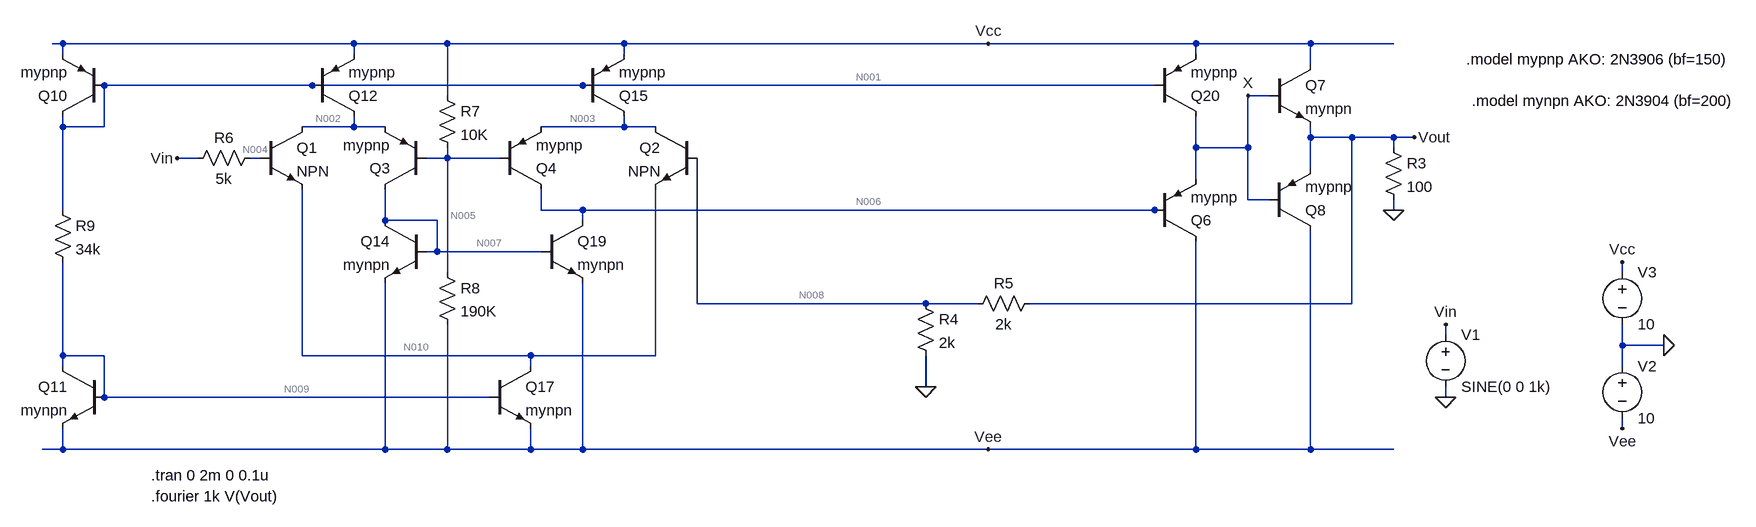
[diagram p0: schematic Design.asc]
Design.asc, the LTspice schematic file:
Version 4
SHEET 1 1876 680
WIRE -736 -240 -752 -240
WIRE -288 -240 -736 -240
WIRE -144 -240 -288 -240
WIRE 128 -240 -144 -240
WIRE 688 -240 128 -240
WIRE 1008 -240 688 -240
WIRE 1184 -240 1008 -240
WIRE 1312 -240 1184 -240
WIRE -736 -224 -736 -240
WIRE -288 -224 -288 -240
WIRE 128 -224 128 -240
WIRE 1008 -224 1008 -240
WIRE 1184 -208 1184 -240
WIRE -352 -176 -672 -176
WIRE 64 -176 -352 -176
WIRE 944 -176 64 -176
WIRE -144 -160 -144 -240
WIRE 1120 -160 1088 -160
WIRE -736 -112 -736 -128
WIRE -672 -112 -672 -176
WIRE -672 -112 -736 -112
WIRE -288 -112 -288 -128
WIRE -288 -112 -368 -112
WIRE -240 -112 -288 -112
WIRE 128 -112 128 -128
WIRE 128 -112 0 -112
WIRE 176 -112 128 -112
WIRE 1184 -96 1184 -112
WIRE 1248 -96 1184 -96
WIRE 1312 -96 1248 -96
WIRE 1344 -96 1312 -96
WIRE 1008 -80 1008 -128
WIRE 1088 -80 1088 -160
WIRE 1088 -80 1008 -80
WIRE 1312 -80 1312 -96
WIRE -528 -64 -560 -64
WIRE -432 -64 -448 -64
WIRE -144 -64 -144 -80
WIRE -144 -64 -176 -64
WIRE -64 -64 -144 -64
WIRE 1184 -48 1184 -96
WIRE 1008 -32 1008 -80
WIRE 1088 0 1088 -80
WIRE 1120 0 1088 0
WIRE -736 16 -736 -112
WIRE 0 16 0 -16
WIRE 64 16 0 16
WIRE 944 16 64 16
WIRE 960 16 944 16
WIRE 1312 16 1312 0
WIRE -240 32 -240 -16
WIRE -160 32 -240 32
WIRE 64 32 64 16
WIRE -160 80 -160 32
WIRE -160 80 -176 80
WIRE 0 80 -160 80
WIRE -144 112 -144 -64
WIRE 1664 112 1664 96
WIRE 240 160 240 -64
WIRE 592 160 240 160
WIRE 672 160 592 160
WIRE 1248 160 1248 -96
WIRE 1248 160 752 160
WIRE 1392 208 1392 192
WIRE 1664 224 1664 192
WIRE 1728 224 1664 224
WIRE -736 240 -736 96
WIRE -672 240 -736 240
WIRE -368 240 -368 -16
WIRE -16 240 -368 240
WIRE 176 240 176 -16
WIRE 176 240 -16 240
WIRE -736 256 -736 240
WIRE -16 256 -16 240
WIRE 1664 256 1664 224
WIRE 592 288 592 240
WIRE -672 304 -672 240
WIRE -80 304 -672 304
WIRE 1392 304 1392 288
WIRE 1664 352 1664 336
WIRE -736 384 -736 352
WIRE -736 384 -768 384
WIRE -240 384 -240 128
WIRE -240 384 -736 384
WIRE -144 384 -144 192
WIRE -144 384 -240 384
WIRE -16 384 -16 352
WIRE -16 384 -144 384
WIRE 64 384 64 128
WIRE 64 384 -16 384
WIRE 688 384 64 384
WIRE 1008 384 1008 64
WIRE 1008 384 688 384
WIRE 1184 384 1184 48
WIRE 1184 384 1008 384
WIRE 1312 384 1184 384
FLAG 1312 16 0
FLAG 592 288 0
FLAG 1344 -96 Vout
FLAG 1728 224 0
FLAG 1664 96 Vcc
FLAG 1664 352 Vee
FLAG 688 384 Vee
FLAG 688 -240 Vcc
FLAG 1392 304 0
FLAG 1392 192 Vin
FLAG 1088 -160 X
FLAG -560 -64 Vin
SYMBOL npn -432 -112 R0
SYMATTR InstName Q1
SYMBOL npn 240 -112 M0
SYMATTR InstName Q2
SYMBOL npn 1120 -208 R0
SYMATTR InstName Q7
SYMATTR Value mynpn
SYMBOL pnp 1120 48 M180
SYMATTR InstName Q8
SYMATTR Value mypnp
SYMBOL res 1296 -96 R0
SYMATTR InstName R3
SYMATTR Value 100
SYMBOL res 576 144 R0
SYMATTR InstName R4
SYMATTR Value 2k
SYMBOL res 768 144 R90
WINDOW 0 0 56 VBottom 2
WINDOW 3 32 56 VTop 2
SYMATTR InstName R5
SYMATTR Value 2k
SYMBOL res -432 -80 R90
WINDOW 0 0 56 VBottom 2
WINDOW 3 32 56 VTop 2
SYMATTR InstName R6
SYMATTR Value 5k
SYMBOL voltage 1392 192 R0
WINDOW 123 0 0 Left 0
WINDOW 39 0 0 Left 0
SYMATTR InstName V1
SYMATTR Value SINE(0 0 1k)
SYMBOL voltage 1664 240 R0
WINDOW 123 0 0 Left 0
WINDOW 39 0 0 Left 0
SYMATTR InstName V2
SYMATTR Value 10
SYMBOL voltage 1664 96 R0
WINDOW 123 0 0 Left 0
WINDOW 39 0 0 Left 0
SYMATTR InstName V3
SYMATTR Value 10
SYMBOL pnp 944 64 M180
SYMATTR InstName Q6
SYMATTR Value mypnp
SYMBOL pnp -176 -16 R180
SYMATTR InstName Q3
SYMATTR Value mypnp
SYMBOL pnp -64 -16 M180
SYMATTR InstName Q4
SYMATTR Value mypnp
SYMBOL pnp -672 -128 R180
SYMATTR InstName Q10
SYMATTR Value mypnp
SYMBOL res -752 0 R0
SYMATTR InstName R9
SYMATTR Value 34k
SYMBOL npn -672 256 M0
SYMATTR InstName Q11
SYMATTR Value mynpn
SYMBOL pnp -352 -128 M180
SYMATTR InstName Q12
SYMATTR Value mypnp
SYMBOL npn -80 256 R0
SYMATTR InstName Q17
SYMATTR Value mynpn
SYMBOL npn 0 32 R0
SYMATTR InstName Q19
SYMATTR Value mynpn
SYMBOL pnp 944 -128 M180
SYMATTR InstName Q20
SYMATTR Value mypnp
SYMBOL res -160 96 R0
SYMATTR InstName R8
SYMATTR Value 190K
SYMBOL res -160 -176 R0
SYMATTR InstName R7
SYMATTR Value 10K
SYMBOL pnp 64 -128 M180
SYMATTR InstName Q15
SYMATTR Value mypnp
SYMBOL npn -176 32 M0
SYMATTR InstName Q14
SYMATTR Value mynpn
TEXT -600 424 Left 2 !.tran 0 2m 0 0.1u
TEXT -600 456 Left 2 !.fourier 1k V(Vout)
TEXT 1424 -216 Left 2 !.model mypnp AKO: 2N3906 (bf=150)
TEXT 1432 -152 Left 2 !.model mynpn AKO: 2N3904 (bf=200)

The netlist it stands for:
* Design.asc
Q1 N002 N004 N010 0 NPN
Q2 N003 N008 N010 0 NPN
Q7 Vcc X Vout 0 mynpn
Q8 Vee X Vout 0 mypnp
R3 Vout 0 100
R4 N008 0 2k
R5 Vout N008 2k
R6 N004 Vin 5k
V1 Vin 0 SINE(0 0 1k)
V2 0 Vee 10
V3 Vcc 0 10
Q6 Vee N006 X 0 mypnp
Q3 N007 N005 N002 0 mypnp
Q4 N006 N005 N003 0 mypnp
Q10 N001 N001 Vcc 0 mypnp
R9 N001 N009 34k
Q11 N009 N009 Vee 0 mynpn
Q12 N002 N001 Vcc 0 mypnp
Q17 N010 N009 Vee 0 mynpn
Q19 N006 N007 Vee 0 mynpn
Q20 X N001 Vcc 0 mypnp
R8 N005 Vee 190K
R7 Vcc N005 10K
Q15 N003 N001 Vcc 0 mypnp
Q14 N007 N007 Vee 0 mynpn
.model NPN NPN
.model PNP PNP
.lib standard.bjt
.tran 0 2m 0 0.1u
.fourier 1k V(Vout)
.model mypnp AKO: 2N3906 (bf=150)
.model mynpn AKO: 2N3904 (bf=200)
.backanno
.end

* Results of the author's LTspice run, read from the files saved beside the schematic
* Operating Point, zero values left out:
*   V(n002) = 9.64 V
*   V(n004) = -14.98 mV
*   V(n010) = -758 mV
*   V(n003) = 9.643 V
*   V(n008) = -16.13 mV
*   V(vcc) = 10 V
*   V(x) = -645.4 mV
*   V(vout) = -26.52 mV
*   V(vee) = -10 V
*   V(n006) = -1.285 V
*   V(n007) = -9.383 V
*   V(n005) = 9.027 V
*   V(n001) = 9.361 V
*   V(n009) = -9.36 V
*   Ic(Q15) = -534.8 µA
*   Ib(Q15) = -3.58 µA
*   Ie(Q15) = 538.4 µA
*   Ic(Q20) = -589.8 µA
*   Ib(Q20) = -3.579 µA
*   Ie(Q20) = 593.4 µA
*   Ic(Q12) = -534.8 µA
*   Ib(Q12) = -3.58 µA
*   Ie(Q12) = 538.4 µA
*   Ic(Q10) = -536.3 µA
*   Ib(Q10) = -3.58 µA
*   Ie(Q10) = 539.9 µA
*   Ic(Q4) = -246.8 µA
*   Ib(Q4) = -1.492 µA
*   Ie(Q4) = 248.2 µA
*   Ic(Q3) = -233.9 µA
*   Ib(Q3) = -1.318 µA
*   Ie(Q3) = 235.3 µA
*   Ic(Q6) = -587.9 µA
*   Ib(Q6) = -3.61 µA
*   Ie(Q6) = 591.5 µA
*   Ic(Q8) = -268.8 µA
*   Ib(Q8) = -1.639 µA
*   Ie(Q8) = 270.4 µA
*   Ic(Q14) = 231.6 µA
*   Ib(Q14) = 1.159 µA
*   Ie(Q14) = -232.8 µA
*   Ic(Q19) = 250.4 µA
*   Ib(Q19) = 1.159 µA
*   Ie(Q19) = -251.5 µA
*   Ic(Q17) = 592 µA
*   Ib(Q17) = 2.729 µA
*   Ie(Q17) = -594.7 µA
*   Ic(Q11) = 545.2 µA
*   Ib(Q11) = 2.73 µA
*   Ie(Q11) = -547.9 µA
*   Ic(Q7) = 10.64 pA
*   Ib(Q7) = -11.27 pA
*   Ic(Q2) = 286.5 µA
*   Ib(Q2) = 2.865 µA
*   Ie(Q2) = -289.4 µA
*   Ic(Q1) = 299.5 µA
*   Ib(Q1) = 2.995 µA
*   Ie(Q1) = -302.5 µA
*   I(R7) = 97.33 µA
*   I(R8) = 100.1 µA
*   I(R9) = 550.6 µA
*   I(R6) = -2.995 µA
*   I(R5) = -5.197 µA
*   I(R4) = -8.063 µA
*   I(R3) = -265.2 µA
*   I(V3) = -2.307 mA
*   I(V2) = -2.584 mA
*   I(V1) = -2.995 µA
* From the log:
*   N-Period=1
*   Fourier components of V(vout)
*   DC component:-0.0265196
*   Harmonic  Frequency   Fourier   Normalized   Phase    Normalized
*    Number     [Hz]     Component   Component  [degree]  Phase [deg]
*       1     1.000e+03  8.350e-25  1.000e+00     99.14°      0.00°
*       2     2.000e+03  3.281e-24  3.930e+00    108.27°      9.13°
*       3     3.000e+03  7.167e-24  8.583e+00    117.37°     18.23°
*       4     4.000e+03  1.221e-23  1.462e+01    126.44°     27.30°
*       5     5.000e+03  1.804e-23  2.161e+01    135.45°     36.31°
*       6     6.000e+03  2.421e-23  2.900e+01    144.39°     45.25°
*       7     7.000e+03  3.022e-23  3.619e+01    153.23°     54.09°
*       8     8.000e+03  3.553e-23  4.256e+01    161.94°     62.79°
*       9     9.000e+03  3.963e-23  4.746e+01    170.47°     71.32°
*   Total Harmonic Distortion: 8356.876323%(119285631391.608350%)